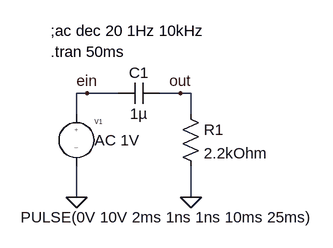
[diagram p0: schematic hochpass-tran.asc]
hochpass-tran.asc, the LTspice schematic file:
Version 4
SHEET 1 880 680
WIRE 64 112 48 112
WIRE 112 112 64 112
WIRE 208 112 176 112
WIRE 224 112 208 112
WIRE 48 144 48 112
WIRE 224 144 224 112
WIRE 48 272 48 224
WIRE 224 272 224 224
FLAG 224 272 0
FLAG 48 272 0
FLAG 208 112 out
FLAG 64 112 ein
SYMBOL res 208 128 R0
SYMATTR InstName R1
SYMATTR Value 2.2kOhm
SYMBOL cap 112 128 R270
WINDOW 0 32 32 VTop 2
WINDOW 3 0 32 VBottom 2
SYMATTR InstName C1
SYMATTR Value 1µ
SYMBOL source-V 48 128 R0
WINDOW 123 28 56 Left 2
WINDOW 39 0 0 Left 2
WINDOW 3 -86 175 Left 2
SYMATTR Value2 AC 1V
SYMATTR InstName V1
SYMATTR Value PULSE(0V 10V 2ms 1ns 1ns 10ms 25ms)
TEXT 8 16 Left 2 !;ac dec 20 1Hz 10kHz
TEXT 8 48 Left 2 !.tran 50ms

The netlist it stands for:
* hochpass-tran.asc
R1 out 0 2.2kOhm
C1 ein out 1µ
V1 ein 0 PULSE(0V 10V 2ms 1ns 1ns 10ms 25ms) AC 1V
;ac dec 20 1Hz 10kHz
.tran 50ms
.backanno
.end